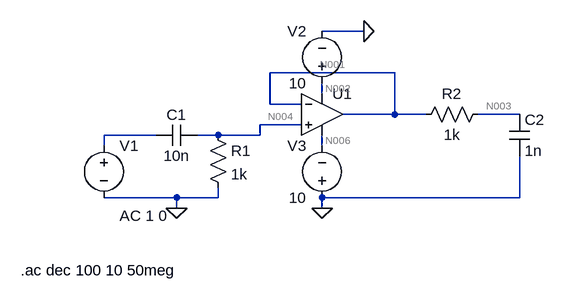
[diagram p0: schematic bandpass_buffer.asc]
bandpass_buffer.asc, the LTspice schematic file:
Version 4
SHEET 1 880 680
WIRE 464 -32 400 -32
WIRE 512 32 320 32
WIRE 400 64 400 48
WIRE 320 80 320 32
WIRE 368 80 320 80
WIRE 512 96 512 32
WIRE 512 96 432 96
WIRE 560 96 512 96
WIRE 704 96 640 96
WIRE 368 112 304 112
WIRE 144 128 64 128
WIRE 240 128 208 128
WIRE 304 128 304 112
WIRE 304 128 240 128
WIRE 64 144 64 128
WIRE 400 144 400 128
WIRE 176 224 64 224
WIRE 240 224 240 208
WIRE 240 224 176 224
WIRE 704 224 704 160
WIRE 704 224 400 224
WIRE 176 240 176 224
WIRE 400 240 400 224
FLAG 176 240 0
FLAG 464 -32 0
FLAG 400 240 0
SYMBOL cap 208 112 R90
WINDOW 0 0 32 VBottom 2
WINDOW 3 32 32 VTop 2
SYMATTR InstName C1
SYMATTR Value 10n
SYMBOL res 224 112 R0
SYMATTR InstName R1
SYMATTR Value 1k
SYMBOL voltage 64 128 R0
WINDOW 123 24 124 Left 2
WINDOW 39 0 0 Left 2
SYMATTR InstName V1
SYMATTR Value ""
SYMATTR Value2 AC 1 0
SYMBOL voltage 400 64 R180
WINDOW 0 24 96 Left 2
WINDOW 3 24 16 Left 2
WINDOW 123 0 0 Left 2
WINDOW 39 0 0 Left 2
SYMATTR InstName V2
SYMATTR Value 10
SYMBOL voltage 400 240 R180
WINDOW 0 24 96 Left 2
WINDOW 3 24 16 Left 2
WINDOW 123 0 0 Left 2
WINDOW 39 0 0 Left 2
SYMATTR InstName V3
SYMATTR Value 10
SYMBOL cap 688 96 R0
SYMATTR InstName C2
SYMATTR Value 1n
SYMBOL res 656 80 R90
WINDOW 0 0 56 VBottom 2
WINDOW 3 32 56 VTop 2
SYMATTR InstName R2
SYMATTR Value 1k
SYMBOL Opamps\\UniversalOpamp2 400 96 R0
SYMATTR InstName U1
TEXT -64 336 Left 2 !.ac dec 100 10 50meg

The netlist it stands for:
* bandpass_buffer.asc
C1 N004 N005 10n
R1 N004 0 1k
V1 N005 0 AC 1 0
V2 N002 0 10
V3 0 N006 10
C2 N003 0 1n
R2 N003 N001 1k
XU1 N004 N001 N002 N006 N001 level.2 Avol=1Meg GBW=10Meg Slew=10Meg ilimit=25m rail=0 Vos=0 phimargin=45 en=0 enk=0 in=0 ink=0 Rin=500Meg  ; pins IN+ IN- V+ V- OUT
.ac dec 100 10 50meg
.lib UniversalOpamps2.sub
.backanno
.end

* Results of the author's LTspice run, read from the files saved beside the schematic
* Operating Point, zero values left out:
*   V(n002) = 10 V
*   V(n006) = -10 V
*   I(V3) = -999.5 µA
*   I(V2) = -999.5 µA
*   Ix(u1:3) = 999.5 µA
*   Ix(u1:4) = -999.5 µA
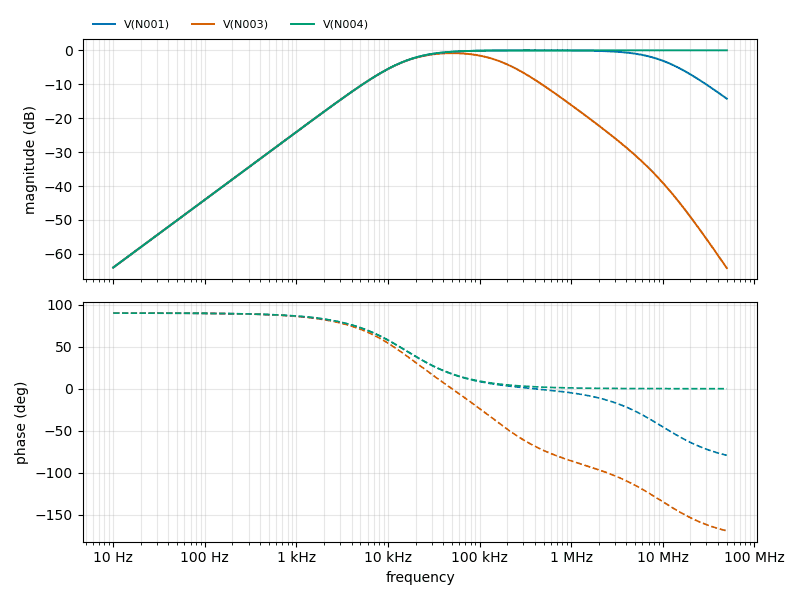
[diagram p1: AC Analysis of bandpass_buffer.asc, plotted from the saved traces]
* AC Analysis, 1 run:
*   V(N001): -64.04 dB at 10 Hz, -14.25 dB at 50 MHz, peak -0.01 dB at 398.1 kHz, 3 dB below the peak at 15.87 kHz and 9.909 MHz
*   V(N003): -64.04 dB at 10 Hz, -64.19 dB at 50 MHz, peak -0.83 dB at 50.12 kHz, 3 dB below the peak at 13.44 kHz and 188.5 kHz
*   V(N004): -64.04 dB at 10 Hz, -0.00 dB at 50 MHz, peak -0.00 dB at 50 MHz, 3 dB below the peak at 15.92 kHz